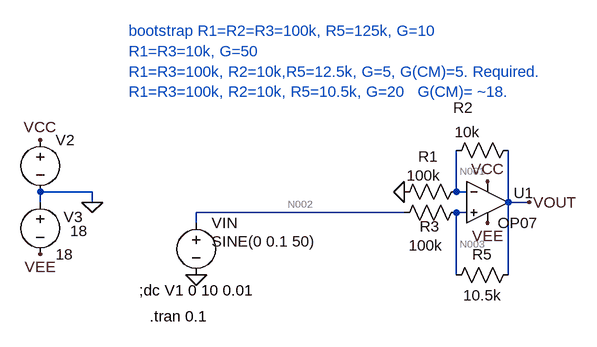
[diagram p0: schematic Draft34.asc]
Draft34.asc, the LTspice schematic file:
Version 4
SHEET 1 880 680
WIRE -192 80 -272 80
WIRE 368 80 368 16
WIRE 384 80 368 80
WIRE -272 96 -272 80
WIRE -192 96 -192 80
WIRE 448 96 448 16
WIRE 480 96 448 96
WIRE 288 112 -32 112
WIRE 384 112 368 112
WIRE -32 128 -32 112
WIRE 368 208 368 112
WIRE 448 208 448 96
FLAG -32 208 0
FLAG -192 96 0
FLAG 480 96 VOUT
FLAG -272 0 VCC
FLAG 416 64 VCC
FLAG -272 176 VEE
FLAG 416 128 VEE
FLAG 288 80 0
SYMBOL voltage -32 112 R0
WINDOW 123 0 0 Left 0
WINDOW 39 0 0 Left 0
WINDOW 3 24 44 Left 2
SYMATTR Value SINE(0 0.1 50)
SYMATTR InstName VIN
SYMBOL OpAmps\\OP07 416 32 R0
WINDOW 0 40 50 Left 2
SYMATTR InstName U1
SYMBOL voltage -272 -16 R0
WINDOW 123 0 0 Left 0
WINDOW 39 0 0 Left 0
WINDOW 3 46 156 Left 2
SYMATTR Value 18
SYMATTR InstName V2
SYMBOL voltage -272 80 R0
WINDOW 123 0 0 Left 0
WINDOW 39 0 0 Left 0
WINDOW 0 36 39 Left 2
SYMATTR InstName V3
SYMATTR Value 18
SYMBOL res 384 64 R90
WINDOW 0 -23 59 VBottom 2
WINDOW 3 -25 66 VTop 2
SYMATTR InstName R1
SYMATTR Value 100k
SYMBOL res 464 0 R90
WINDOW 0 -34 85 VBottom 2
WINDOW 3 -28 79 VTop 2
SYMATTR InstName R2
SYMATTR Value 10k
SYMBOL res 384 96 R90
WINDOW 0 53 57 VBottom 2
WINDOW 3 51 63 VTop 2
SYMATTR InstName R3
SYMATTR Value 100k
SYMBOL res 464 192 R90
WINDOW 0 0 56 VBottom 2
WINDOW 3 32 56 VTop 2
SYMATTR InstName R5
SYMATTR Value 10.5k
TEXT -120 232 Left 2 !;dc V1 0 10 0.01
TEXT -104 272 Left 2 !.tran 0.1
TEXT -136 -168 Left 2 ;bootstrap R1=R2=R3=100k, R5=125k, G=10\nR1=R3=10k, G=50\nR1=R3=100k, R2=10k,R5=12.5k, G=5, G(CM)=5. Required.\nR1=R3=100k, R2=10k, R5=10.5k, G=20   G(CM)= ~18.

The netlist it stands for:
* Draft34.asc
VIN N002 0 SINE(0 0.1 50)
XU1 N003 N001 VCC VEE VOUT LT1001  ; OP07, pins In+ In- V+ V- OUT
V2 VCC 0 18
V3 0 VEE 18
R1 N001 0 100k
R2 VOUT N001 10k
R3 N003 N002 100k
R5 VOUT N003 10.5k
;dc V1 0 10 0.01
.tran 0.1
* bootstrap R1=R2=R3=100k, R5=125k, G=10
* R1=R3=10k, G=50
* R1=R3=100k, R2=10k,R5=12.5k, G=5, G(CM)=5. Required.
* R1=R3=100k, R2=10k, R5=10.5k, G=20   G(CM)= ~18.
.lib LTC.lib
.backanno
.end

* Results of the author's LTspice run, read from the files saved beside the schematic
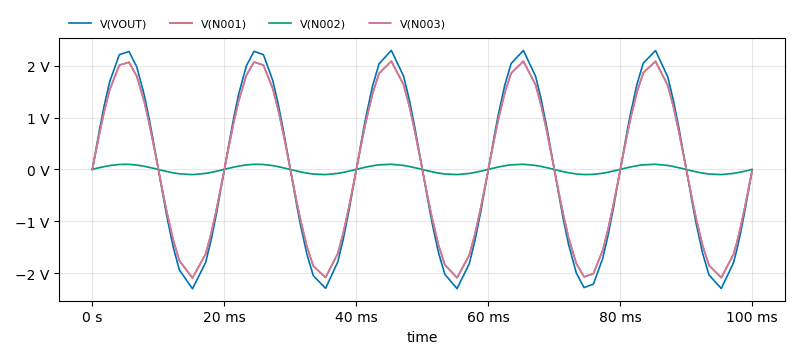
[diagram p1: Transient Analysis of Draft34.asc, plotted from the saved traces]
* Transient Analysis, 1 run:
*   V(VOUT): min -2.303 V, max 2.297 V, average 1.404 mV, rms 1.61 V, last -33 mV
*   V(N001): min -2.094 V, max 2.088 V, average 1.276 mV, rms 1.464 V, last -30 mV
*   V(N002): min -99.68 mV, max 99.35 mV, average 59.99 µV, rms 69.76 mV, last 0 V
*   V(N003): min -2.094 V, max 2.088 V, average 1.276 mV, rms 1.464 V, last -29.87 mV